# EAGLE design kilo (EAGLE 9.4.0)

## Sheet 1 of 5: ESP32
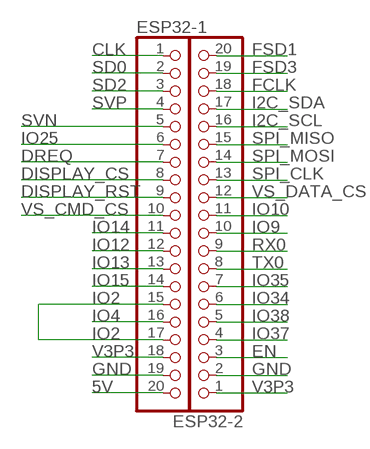
[diagram p0: schematic, sheet 1]

### Parts
ESP32-1  PINHD-1X20  [1X20]
ESP32-2  PINHD-1X20  [1X20]

### Nets
5V: ESP32-1.20
CLK: ESP32-1.1
DISPLAY_CS: ESP32-1.8 ; also sheet 3
DISPLAY_RST: ESP32-1.9 ; also sheet 3
DREQ: ESP32-1.7 ; also sheet 2
EN: ESP32-2.3
FCLK: ESP32-2.18
FSD1: ESP32-2.20
FSD3: ESP32-2.19
GND: ESP32-1.19 ESP32-2.2 ; also sheet 2,3,4,5
I2C_SCL: ESP32-2.16
I2C_SDA: ESP32-2.17
IO2: ESP32-1.15 ESP32-1.17 ; also sheet 4
IO4: ESP32-1.16 ; also sheet 4
IO9: ESP32-2.10 ; also sheet 3
IO10: ESP32-2.11 ; also sheet 5
IO12: ESP32-1.12 ; also sheet 4
IO13: ESP32-1.13 ; also sheet 4
IO14: ESP32-1.11 ; also sheet 4
IO15: ESP32-1.14 ; also sheet 4
IO25: ESP32-1.6 ; also sheet 5
IO34: ESP32-2.6
IO35: ESP32-2.7
IO37: ESP32-2.4 ; also sheet 5
IO38: ESP32-2.5 ; also sheet 5
RX0: ESP32-2.9
SD0: ESP32-1.2
SD2: ESP32-1.3
SPI_CLK: ESP32-2.13 ; also sheet 2,3
SPI_MISO: ESP32-2.15 ; also sheet 2,3
SPI_MOSI: ESP32-2.14 ; also sheet 2,3
SVN: ESP32-1.5
SVP: ESP32-1.4 ; also sheet 5
TX0: ESP32-2.8
V3P3: ESP32-1.18 ESP32-2.1 ; also sheet 2,3,4,5
VS_CMD_CS: ESP32-1.10 ; also sheet 2
VS_DATA_CS: ESP32-2.12 ; also sheet 2

## Sheet 2 of 5: VS1053
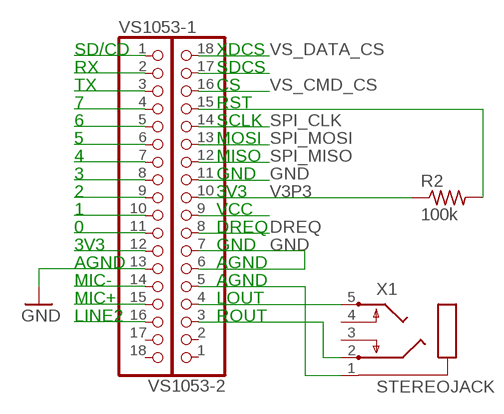
[diagram p1: schematic, sheet 2]

### Parts
R2  100k  R-US_0207/10  [0207/10]
VS1053-1  PINHD-1X18  [1X18]
VS1053-2  PINHD-1X18  [1X18]
X1  STEREOJACK  [STX3100]

### Nets
DREQ: VS1053-2.8 ; also sheet 1
GND: VS1053-1.13 VS1053-2.6 VS1053-2.7 VS1053-2.11 ; also sheet 1,3,4,5
N$1: VS1053-1.9
N$2: VS1053-1.1
N$3: VS1053-1.2
N$4: VS1053-1.3
N$5: VS1053-1.4
N$6: VS1053-1.5
N$7: VS1053-1.6
N$8: VS1053-1.7
N$9: VS1053-1.8
N$10: VS1053-1.10
N$11: VS1053-1.11
N$12: VS1053-1.12
N$13: VS1053-2.4 X1.5
N$14: VS1053-1.14
N$15: VS1053-1.15
N$16: VS1053-1.16
N$17: VS1053-2.3 X1.2
N$18: VS1053-2.17
N$20: R2.2 VS1053-2.15
N$21: VS1053-2.5 X1.1
N$26: VS1053-2.9
SPI_CLK: VS1053-2.14 ; also sheet 1,3
SPI_MISO: VS1053-2.12 ; also sheet 1,3
SPI_MOSI: VS1053-2.13 ; also sheet 1,3
V3P3: R2.1 VS1053-2.10 ; also sheet 1,3,4,5
VS_CMD_CS: VS1053-2.16 ; also sheet 1
VS_DATA_CS: VS1053-2.18 ; also sheet 1
Unconnected: VS1053-1.17 VS1053-1.18 VS1053-2.1 VS1053-2.2 X1.3 X1.4

### Notes on the sheet
- SD/CD | XDCS
- RX | SDCS
- TX | CS
- 7 | RST
- 6 | SCLK
- 5 | MOSI
- 4 | MISO
- 3 | GND
- 2 | 3V3
- 1 | VCC
- 0 | DREQ
- 3V3 | GND
- AGND | AGND
- MIC- | AGND
- MIC+ | LOUT
- LINE2 | ROUT

## Sheet 3 of 5: DISPLAY
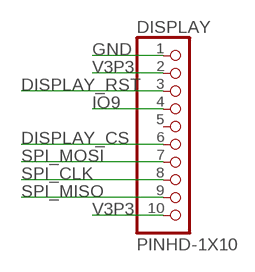
[diagram p2: schematic, sheet 3]

### Parts
DISPLAY  PINHD-1X10  [1X10-BIG]

### Nets
DISPLAY_CS: DISPLAY.6 ; also sheet 1
DISPLAY_RST: DISPLAY.3 ; also sheet 1
GND: DISPLAY.1 ; also sheet 1,2,4,5
IO9: DISPLAY.4 ; also sheet 1
SPI_CLK: DISPLAY.8 ; also sheet 1,2
SPI_MISO: DISPLAY.9 ; also sheet 1,2
SPI_MOSI: DISPLAY.7 ; also sheet 1,2
V3P3: DISPLAY.2 DISPLAY.10 ; also sheet 1,2,4,5
Unconnected: DISPLAY.5

## Sheet 4 of 5: SD CARD
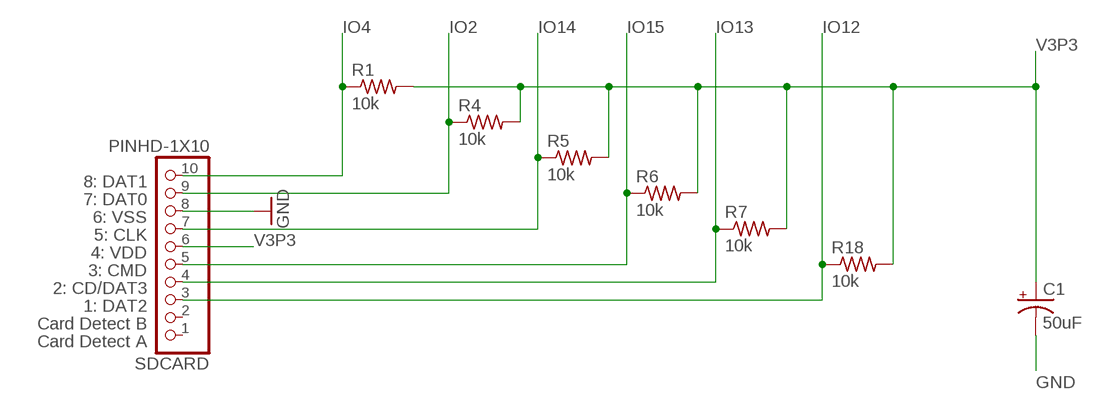
[diagram p3: schematic, sheet 4]

### Parts
C1  50uF  CPOL-USE2.5-7  [E2,5-7]
R1  10k  R-US_0207/10  [0207/10]
R4  10k  R-US_0207/10  [0207/10]
R5  10k  R-US_0207/10  [0207/10]
R6  10k  R-US_0207/10  [0207/10]
R7  10k  R-US_0207/10  [0207/10]
R18  10k  R-US_0207/10  [0207/10]
SDCARD  PINHD-1X10  [1X10-BIG]

### Nets
GND: C1.- SDCARD.8 ; also sheet 1,2,3,5
IO2: R4.1 SDCARD.9 ; also sheet 1
IO4: R1.1 SDCARD.10 ; also sheet 1
IO12: R18.1 SDCARD.3 ; also sheet 1
IO13: R7.1 SDCARD.4 ; also sheet 1
IO14: R5.1 SDCARD.7 ; also sheet 1
IO15: R6.1 SDCARD.5 ; also sheet 1
V3P3: C1.+ R1.2 R4.2 R5.2 R6.2 R7.2 R18.2 SDCARD.6 ; also sheet 1,2,3,5
Unconnected: SDCARD.1 SDCARD.2

### Notes on the sheet
- 8: DAT1
- 7: DAT0
- 6: VSS
- 5: CLK
- 4: VDD
- 3: CMD
- 2: CD/DAT3
- 1: DAT2
- Card Detect B
- Card Detect A

## Sheet 5 of 5: BUTTONS
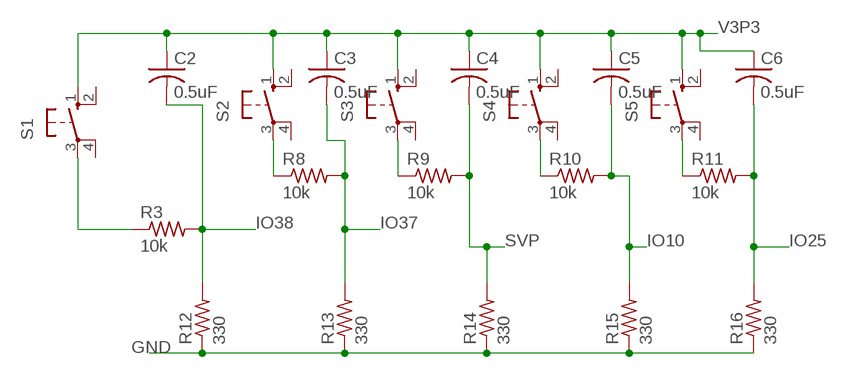
[diagram p4: schematic, sheet 5]

### Parts
C2  0.5uF  C-US025-024X044  [C025-024X044]
C3  0.5uF  C-US025-024X044  [C025-024X044]
C4  0.5uF  C-US025-024X044  [C025-024X044]
C5  0.5uF  C-US025-024X044  [C025-024X044]
C6  0.5uF  C-US025-024X044  [C025-024X044]
R3  10k  R-US_0207/10  [0207/10]
R8  10k  R-US_0207/10  [0207/10]
R9  10k  R-US_0207/10  [0207/10]
R10  10k  R-US_0207/10  [0207/10]
R11  10k  R-US_0207/10  [0207/10]
R12  330  R-US_0207/10  [0207/10]
R13  330  R-US_0207/10  [0207/10]
R14  330  R-US_0207/10  [0207/10]
R15  330  R-US_0207/10  [0207/10]
R16  330  R-US_0207/10  [0207/10]
S1  10-XX  [B3F-10XX]
S2  10-XX  [B3F-10XX]
S3  10-XX  [B3F-10XX]
S4  10-XX  [B3F-10XX]
S5  10-XX  [B3F-10XX]

### Nets
GND: R12.1 R13.1 R14.1 R15.1 R16.1 ; also sheet 1,2,3,4
IO10: C5.2 R10.2 R15.2 ; also sheet 1
IO25: C6.2 R11.2 R16.2 ; also sheet 1
IO37: C3.2 R8.2 R13.2 ; also sheet 1
IO38: C2.2 R3.2 R12.2 ; also sheet 1
N$19: R3.1 S1.3(P)
N$22: R8.1 S2.3(P)
N$23: R9.1 S3.3(P)
N$24: R10.1 S4.3(P)
N$25: R11.1 S5.3(P)
SVP: C4.2 R9.2 R14.2 ; also sheet 1
V3P3: C2.1 C3.1 C4.1 C5.1 C6.1 S1.1(S) S2.1(S) S3.1(S) S4.1(S) S5.1(S) ; also sheet 1,2,3,4
Unconnected: S1.2(S1) S1.4(P1) S2.2(S1) S2.4(P1) S3.2(S1) S3.4(P1) S4.2(S1) S4.4(P1) S5.2(S1) S5.4(P1)

## Library data of the parts
C1 = rcl:CPOL-US: POLARIZED CAPACITOR, American symbol; SPICEPREFIX: C
C2-C6 = rcl:C-US: CAPACITOR, American symbol; SPICEPREFIX: C
DISPLAY SDCARD = adafruit:PINHD-1X10: Pin header 1x10 0.1" spacing With round pins
ESP32-1 ESP32-2 = adafruit:PINHD-1X20: PIN HEADER
R1-R16 R18 = rcl:R-US_: RESISTOR, American symbol; SPICEPREFIX: R
S1-S5 = switch-omron:10-XX: OMRON SWITCH; MPN: B3F-1000; OC_FARNELL: 176432; OC_NEWARK: 36M3542
VS1053-1 VS1053-2 = adafruit:PINHD-1X18: PIN HEADER
X1 = adafruit:STEREOJACK: MIC/HEADPHONE JACK Stereo jack with two switches. Kycon STX3100, CUI SJ1-3555NG and/or 4UCon 05544

## Board
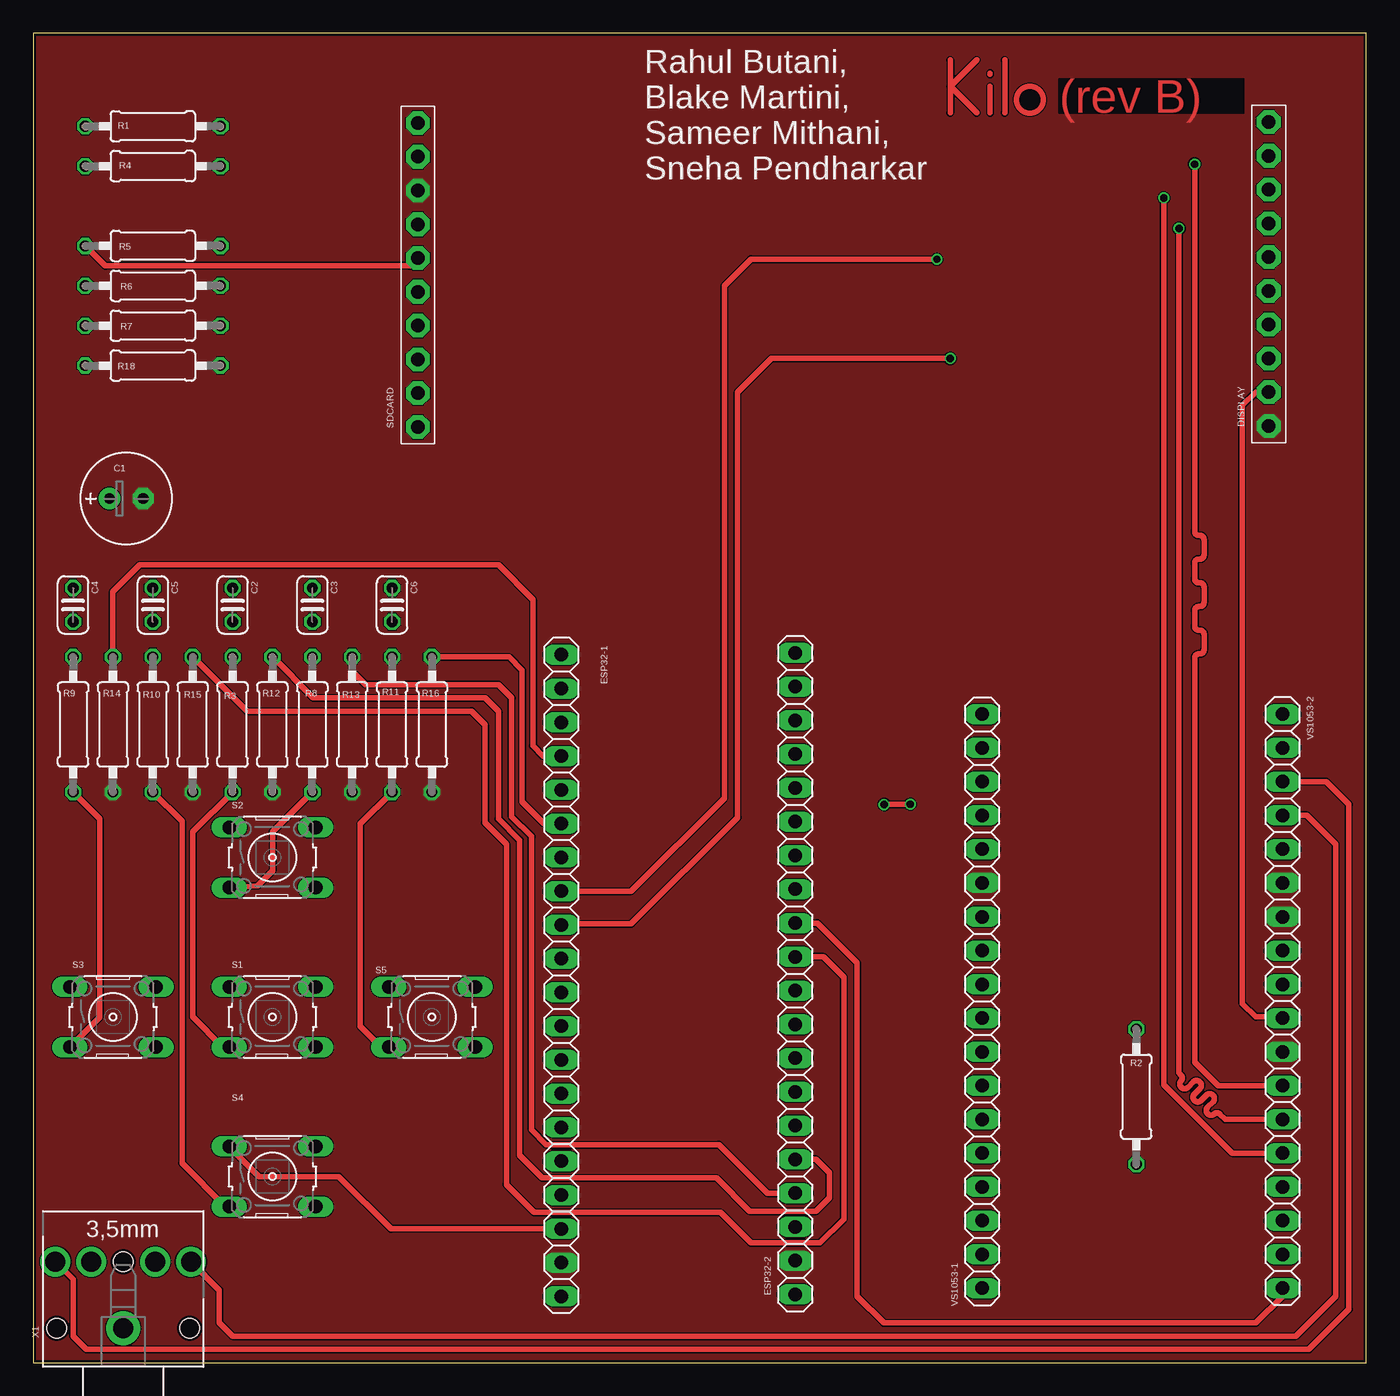
[diagram p5: board, top side]
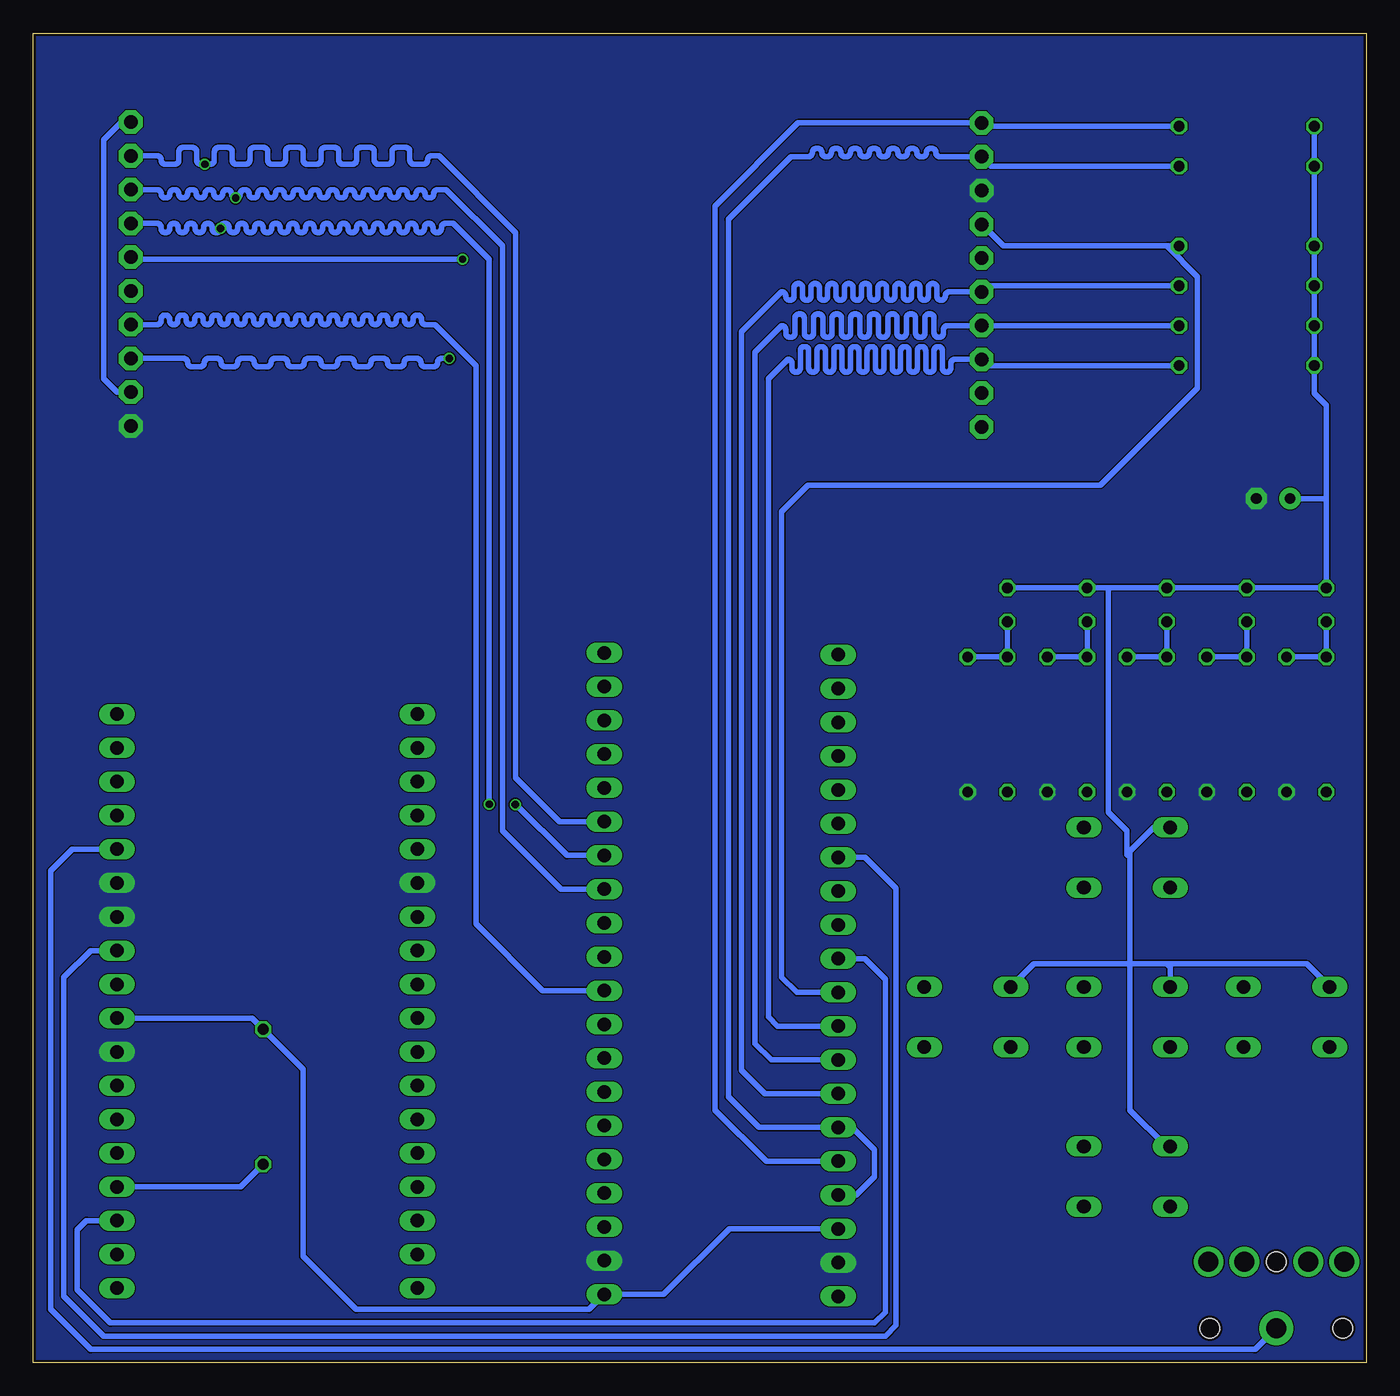
[diagram p6: board, bottom side, seen from below]

Size 100.31 x 100 mm. Coordinates in mm from the lower left corner, seen from the top.
Outline: 0,0 100.31,0 100.31,100 0,100 0,0
Copper layers (1*16): Top 0.035mm / dielectric 1.5mm / Bottom 0.035mm
Design rules "jlcpcb *": minimum track width 3.5mil, minimum drill 0.2mm, track to track 3.5mil, track to pad 3.5mil, pad to pad 6mil, via to via 6mil, smd to smd 6mil, copper to edge 0.2mm, drill to drill 0.2mm, minimum pad ring 3mil, minimum via ring 3mil, stop-mask expansion 4mil, vias tented up to drill 0mil, thermal gap 10mil

### Footprints (pad centres in the part's own frame; a part is rotated, then mirrored left to right if it is on the bottom)
E2,5-7 = drill 0.813 pad 1.6: + -1.27,0 | drill 0.813 pad 1.6 octagon: - 1.27,0
C025-024X044 = drill 0.813 octagon: 1 -1.27,0; 2 1.27,0
1X10-BIG = drill 1.016 pad 1.778 octagon: 1 -11.43,0; 2 -8.89,0; 3 -6.35,0; 4 -3.81,0; 5 -1.27,0; 6 1.27,0; 7 3.81,0; 8 6.35,0; 9 8.89,0; 10 11.43,0
1X20 = drill 1.016 long: 1 -24.13,0; 2 -21.59,0; 3 -19.05,0; 4 -16.51,0; 5 -13.97,0; 6 -11.43,0; 7 -8.89,0; 8 -6.35,0; 9 -3.81,0; 10 -1.27,0; 11 1.27,0; 12 3.81,0; 13 6.35,0; 14 8.89,0; 15 11.43,0; 16 13.97,0; 17 16.51,0; 18 19.05,0; 19 21.59,0; 20 24.13,0
0207/10 = drill 0.813 octagon: 1 -5.08,0; 2 5.08,0
B3F-10XX = drill 1.016 long: 1 -3.251,2.261; 2 3.251,2.261; 3 -3.251,-2.261; 4 3.251,-2.261
1X18 = drill 1.016 long: 1 -21.59,0; 2 -19.05,0; 3 -16.51,0; 4 -13.97,0; 5 -11.43,0; 6 -8.89,0; 7 -6.35,0; 8 -3.81,0; 9 -1.27,0; 10 1.27,0; 11 3.81,0; 12 6.35,0; 13 8.89,0; 14 11.43,0; 15 13.97,0; 16 16.51,0; 17 19.05,0; 18 21.59,0
STX3100 = drill 1.5 pad 2.54: 1 2.7,-0.1 | drill 1.5: 2 7.7,5; 3 7.7,2.3; 4 7.7,-2.5; 5 7.7,-5.2 | hole 1.5: 2.7,4.9; 2.7,-5.1; 7.7,-0.1

### Placement (x,y rotation side)
C1  7,65 0 top
C2  15,57 270 top
C3  21,57 270 top
C4  3,57 270 top
C5  9,57 270 top
C6  27,57 270 top
DISPLAY  92.97,81.89 90 top
ESP32-1  39.74,29.12 270 top
ESP32-2  57.34,29.26 90 top
R1  9,93 180 top
R2  83,20 270 top
R3  15,48 90 top
R4  9,90 180 top
R5  9,84 180 top
R6  9,81 180 top
R7  9,78 180 top
R8  21,48 90 top
R9  3,48 90 top
R10  9,48 90 top
R11  27,48 90 top
R12  18,48 90 top
R13  24,48 90 top
R14  6,48 90 top
R15  12,48 90 top
R16  30,48 90 top
R18  9,75 180 top
S1  18,26 0 top
S2  18,38 0 top
S3  6,26 0 top
S4  18,14 0 top
S5  30,26 0 top
SDCARD  28.94,81.82 90 top
VS1053-1  71.41,27.19 90 top
VS1053-2  94.01,27.19 270 top
X1  6.67,-0.11 90 top

### Tracks (layer width: path | path; a pad name or v marks a point on that pad's centre or on a via)
DISPLAY_CS  (via drill 0.55)
  Top 0.406: ESP32-1.8 45,35.47 52,42.47 52,81 54,83 v68,83
  Bottom 0.406: DISPLAY.6 92.81,83 v68,83
DISPLAY_RST  (via drill 0.55)
  Top 0.406: ESP32-1.9 39.81,33 45,33 53,41 53,73 55.54,75.54 v69,75.54
  Bottom 0.406: DISPLAY.3 89,75.54 arc90 88.69,75.23 arc-90 88.37,74.91 87.75,74.91 arc-90 87.43,75.23 arc90 87.12,75.54 86.49,75.54 arc90 86.18,75.23 arc-90 85.86,74.91 85.24,74.91 arc-90 84.93,75.23 arc90 84.61,75.54 83.99,75.54 arc90 83.67,75.23 arc-90 83.36,74.91 82.73,74.91 arc-90 82.42,75.23 arc90 82.11,75.54 81.48,75.54 arc90 81.17,75.23 arc-90 80.85,74.91 80.23,74.91 arc-90 79.91,75.23 arc90 79.6,75.54 78.97,75.54 arc90 78.66,75.23 arc-90 78.34,74.91 77.72,74.91 arc-90 77.41,75.23 arc90 77.09,75.54 76.47,75.54 arc90 76.15,75.23 arc-90 75.84,74.91 75.21,74.91 arc-90 74.9,75.23 arc90 74.58,75.54 73.96,75.54 arc90 73.65,75.23 arc-90 73.33,74.91 72.71,74.91 arc-90 72.39,75.23 arc90 72.08,75.54 71.45,75.54 arc90 71.14,75.23 arc-90 70.83,74.91 70.2,74.91 arc-90 69.89,75.23 arc90 69.57,75.54 v69,75.54
DREQ
  Bottom 0.406: ESP32-1.7 37.74,38.01 35.4,35.67 35.4,2.8 36.2,2 95,2 98,5 98,29 96,31 VS1053-2.8
GND
  pour Top (rank 2, no thermals): 0,100 100.2,100 100.2,0 0,0
  pour Bottom (rank 2, no thermals): 0,100 100.2,100 100.2,0 0,0
IO2
  Bottom 0.406: R4.1 28.23,90 SDCARD.9 32.07,90.71 arc90 32.39,91.02 arc-90 32.7,91.34 32.79,91.34 arc-90 33.1,91.02 arc90 33.42,90.71 33.51,90.71 arc90 33.82,91.02 arc-90 34.13,91.34 34.22,91.34 arc-90 34.53,91.02 arc90 34.85,90.71 34.94,90.71 arc90 35.25,91.02 arc-90 35.56,91.34 35.65,91.34 arc-90 35.96,91.02 arc90 36.28,90.71 36.37,90.71 arc90 36.68,91.02 arc-90 36.99,91.34 37.08,91.34 arc-90 37.4,91.02 arc90 37.71,90.71 37.8,90.71 arc90 38.11,91.02 arc-90 38.42,91.34 38.51,91.34 arc-90 38.83,91.02 arc90 39.14,90.71 39.23,90.71 arc90 39.54,91.02 arc-90 39.85,91.34 39.94,91.34 arc-90 40.26,91.02 arc90 40.57,90.71 40.66,90.71 arc90 40.97,91.02 arc-90 41.28,91.34 41.37,91.34 arc-90 41.69,91.02 arc90 42,90.71 43.29,90.71 48,86 48,20 45.69,17.69 ESP32-1.15 38.69,17.69 37,16 37,14 38.39,12.61 ESP32-1.17
IO4
  Bottom 0.406: R1.1 28.69,93 SDCARD.10 42.75,93.25 49,87 49,19 45.15,15.15 ESP32-1.16
IO9
  Bottom 0.406: DISPLAY.4 91,78.08 arc-90 90.69,78.39 90.69,78.49 arc90 90.37,78.8 90.37,78.8 arc90 90.05,78.49 90.05,78.39 arc-90 89.74,78.08 89.74,78.08 arc-90 89.42,78.39 89.42,78.49 arc90 89.11,78.8 89.1,78.8 arc90 88.79,78.49 88.79,78.39 arc-90 88.48,78.08 88.47,78.08 arc-90 88.16,78.39 88.16,78.49 arc90 87.84,78.8 87.84,78.8 arc90 87.53,78.49 87.53,78.39 arc-90 87.21,78.08 87.21,78.08 arc-90 86.89,78.39 86.89,78.49 arc90 86.58,78.8 86.58,78.8 arc90 86.26,78.49 86.26,78.39 arc-90 85.95,78.08 85.94,78.08 arc-90 85.63,78.39 85.63,78.49 arc90 85.32,78.8 85.31,78.8 arc90 85,78.49 85,78.39 arc-90 84.69,78.08 84.68,78.08 arc-90 84.37,78.39 84.37,78.49 arc90 84.05,78.8 84.05,78.8 arc90 83.73,78.49 83.73,78.39 arc-90 83.42,78.08 83.42,78.08 arc-90 83.1,78.39 83.1,78.49 arc90 82.79,78.8 82.79,78.8 arc90 82.47,78.49 82.47,78.39 arc-90 82.16,78.08 82.15,78.08 arc-90 81.84,78.39 81.84,78.49 arc90 81.53,78.8 81.52,78.8 arc90 81.21,78.49 81.21,78.39 arc-90 80.89,78.08 80.89,78.08 arc-90 80.58,78.39 80.58,78.49 arc90 80.26,78.8 80.26,78.8 arc90 79.94,78.49 79.94,78.39 arc-90 79.63,78.08 79.63,78.08 arc-90 79.31,78.39 79.31,78.49 arc90 79,78.8 78.99,78.8 arc90 78.68,78.49 78.68,78.39 arc-90 78.37,78.08 78.36,78.08 arc-90 78.05,78.39 78.05,78.49 arc90 77.73,78.8 77.73,78.8 arc90 77.42,78.49 77.42,78.39 arc-90 77.1,78.08 77.1,78.08 arc-90 76.78,78.39 76.78,78.49 arc90 76.47,78.8 76.47,78.8 arc90 76.15,78.49 76.15,78.39 arc-90 75.84,78.08 75.83,78.08 arc-90 75.52,78.39 75.52,78.49 arc90 75.21,78.8 75.2,78.8 arc90 74.89,78.49 74.89,78.39 arc-90 74.58,78.08 74.57,78.08 arc-90 74.26,78.39 74.26,78.49 arc90 73.94,78.8 73.94,78.8 arc90 73.62,78.49 73.62,78.39 arc-90 73.31,78.08 73.31,78.08 arc-90 72.99,78.39 72.99,78.49 arc90 72.68,78.8 72.68,78.8 arc90 72.36,78.49 72.36,78.39 arc-90 72.05,78.08 72.04,78.08 arc-90 71.73,78.39 71.73,78.49 arc90 71.42,78.8 71.41,78.8 arc90 71.1,78.49 71.1,78.39 arc-90 70.78,78.08 70.08,78.08 67,75 67,33 61.99,27.99 ESP32-2.10
IO10
  Top 0.406: R15.2 16.08,49 33,49 34,48 34,40.6 35.6,39 35.6,13.4 37.7,11.3 51.7,11.3 54,9 59.2,9 61,10.8 61,29 59.47,30.53 ESP32-2.11
  Bottom 0.406: R15.2 R10.2 C5.2
IO12
  Bottom 0.406: R18.1 28.47,75 SDCARD.3 30.95,75.47 arc-90 31.27,75.16 31.27,74.82 arc90 31.58,74.5 | 31.58,74.5 | 31.58,74.5 arc90 31.9,74.82 31.9,76.12 arc-90 32.21,76.44 32.21,76.44 arc-90 32.52,76.12 32.52,74.82 arc90 32.84,74.5 32.84,74.5 arc90 33.15,74.82 33.15,76.12 arc-90 33.47,76.44 | 33.47,76.44 | 33.47,76.44 arc-90 33.78,76.12 33.78,74.82 arc90 34.1,74.5 | 34.1,74.5 | 34.1,74.5 arc90 34.41,74.82 34.41,76.12 arc-90 34.73,76.44 | 34.73,76.44 | 34.73,76.44 arc-90 35.04,76.12 35.04,74.82 arc90 35.35,74.5 | 35.35,74.5 | 35.35,74.5 arc90 35.67,74.82 35.67,76.12 arc-90 35.98,76.44 | 35.98,76.44 | 35.98,76.44 arc-90 36.3,76.12 36.3,74.82 arc90 36.61,74.5 | 36.61,74.5 | 36.61,74.5 arc90 36.93,74.82 36.93,76.12 arc-90 37.24,76.44 37.24,76.44 arc-90 37.56,76.12 37.56,74.82 arc90 37.87,74.5 | 37.87,74.5 | 37.87,74.5 arc90 38.19,74.82 38.19,76.12 arc-90 38.5,76.44 | 38.5,76.44 | 38.5,76.44 arc-90 38.81,76.12 38.81,74.82 arc90 39.13,74.5 | 39.13,74.5 | 39.13,74.5 arc90 39.44,74.82 39.44,76.12 arc-90 39.76,76.44 | 39.76,76.44 | 39.76,76.44 arc-90 40.07,76.12 40.07,74.82 arc90 40.39,74.5 | 40.39,74.5 | 40.39,74.5 arc90 40.7,74.82 40.7,76.12 arc-90 41.02,76.44 | 41.02,76.44 | 41.02,76.44 arc-90 41.33,76.12 41.33,74.82 arc90 41.64,74.5 41.64,74.5 arc90 41.96,74.82 41.96,76.12 arc-90 42.27,76.44 | 42.27,76.44 | 42.27,76.44 arc-90 42.59,76.12 42.59,74.82 arc90 42.9,74.5 | 42.9,74.5 | 42.9,74.5 arc90 43.22,74.82 43.22,75.16 arc-90 43.53,75.47 45,74 45,26 44.31,25.31 ESP32-1.12
IO13
  Bottom 0.406: R7.1 SDCARD.4 31.51,78.01 arc-90 31.82,77.7 31.82,77.45 arc90 32.14,77.14 32.2,77.14 arc90 32.52,77.45 32.52,78.57 arc-90 32.83,78.88 32.9,78.88 arc-90 33.22,78.57 33.22,77.45 arc90 33.53,77.14 33.6,77.14 arc90 33.91,77.45 33.91,78.57 arc-90 34.23,78.88 34.3,78.88 arc-90 34.61,78.57 34.61,77.45 arc90 34.93,77.14 35,77.14 arc90 35.31,77.45 35.31,78.57 arc-90 35.62,78.88 35.69,78.88 arc-90 36.01,78.57 36.01,77.45 arc90 36.32,77.14 36.39,77.14 arc90 36.71,77.45 36.71,78.57 arc-90 37.02,78.88 37.09,78.88 arc-90 37.41,78.57 37.41,77.45 arc90 37.72,77.14 37.79,77.14 arc90 38.1,77.45 38.1,78.57 arc-90 38.42,78.88 38.49,78.88 arc-90 38.8,78.57 38.8,77.45 arc90 39.12,77.14 39.18,77.14 arc90 39.5,77.45 39.5,78.57 arc-90 39.81,78.88 39.88,78.88 arc-90 40.2,78.57 40.2,77.45 arc90 40.51,77.14 40.58,77.14 arc90 40.89,77.45 40.89,78.57 arc-90 41.21,78.88 41.28,78.88 arc-90 41.59,78.57 41.59,77.45 arc90 41.91,77.14 41.98,77.14 arc90 42.29,77.45 42.29,78.57 arc-90 42.6,78.88 42.67,78.88 arc-90 42.99,78.57 42.99,77.45 arc90 43.3,77.14 43.37,77.14 arc90 43.69,77.45 43.69,77.7 arc-90 44,78.01 46,76.01 46,24 44.77,22.77 ESP32-1.13
IO14
  Bottom 0.406: SDCARD.7 27.31,84 15,84 | R5.1 15,84 | 15,84 12.7,81.7 12.7,73.3 20,66 42,66 44,64 44,29 42.85,27.85 ESP32-1.11
IO15
  Bottom 0.406: R6.1 28.49,81 SDCARD.5 31.37,80.55 arc-90 31.68,80.24 arc90 32,79.92 32,79.92 arc90 32.31,80.24 32.31,80.86 arc-90 32.63,81.18 32.63,81.18 arc-90 32.95,80.86 32.95,80.24 arc90 33.26,79.92 33.26,79.92 arc90 33.58,80.24 33.58,80.86 arc-90 33.89,81.18 33.9,81.18 arc-90 34.21,80.86 34.21,80.24 arc90 34.52,79.92 34.53,79.92 arc90 34.84,80.24 34.84,80.86 arc-90 35.16,81.18 35.16,81.18 arc-90 35.47,80.86 35.47,80.24 arc90 35.79,79.92 35.79,79.92 arc90 36.1,80.24 36.1,80.86 arc-90 36.42,81.18 36.42,81.18 arc-90 36.74,80.86 36.74,80.24 arc90 37.05,79.92 37.05,79.92 arc90 37.37,80.24 37.37,80.86 arc-90 37.68,81.18 37.69,81.18 arc-90 38,80.86 38,80.24 arc90 38.31,79.92 38.32,79.92 arc90 38.63,80.24 38.63,80.86 arc-90 38.95,81.18 38.95,81.18 arc-90 39.26,80.86 39.26,80.24 arc90 39.58,79.92 39.58,79.92 arc90 39.9,80.24 39.9,80.86 arc-90 40.21,81.18 40.21,81.18 arc-90 40.53,80.86 40.53,80.24 arc90 40.84,79.92 40.84,79.92 arc90 41.16,80.24 41.16,80.86 arc-90 41.47,81.18 41.48,81.18 arc-90 41.79,80.86 41.79,80.24 arc90 42.1,79.92 42.11,79.92 arc90 42.42,80.24 42.42,80.86 arc-90 42.74,81.18 42.74,81.18 arc-90 43.05,80.86 43.05,80.24 arc90 43.37,79.92 43.37,79.92 arc90 43.69,80.24 arc-90 44,80.55 47,77.55 47,22 45.23,20.23 ESP32-1.14
IO25
  Top 0.406: R16.2 35.8,53.08 36.8,52.08 36.8,42.2 38.45,40.55 ESP32-1.6
  Bottom 0.406: C6.2 R11.2 R16.2
IO37
  Top 0.406: ESP32-2.4 55.25,12.75 51.6,16.4 38.6,16.4 37.5,17.5 37.5,39.58 36,41.08 36,50 35,51 25,51 24,52 R13.2
  Bottom 0.406: C3.2 R8.2 R13.2
IO38
  Top 0.406: R12.2 21.08,50 34,50 35,49 35,40.9 36.6,39.3 36.6,15.6 38.3,13.9 51.4,13.9 53.9,11.4 58.9,11.4 59.9,12.4 59.9,14.3 58.91,15.29 ESP32-2.5
  Bottom 0.406: C2.2 R3.2 R12.2
N$13
  Top 0.406: X1.5 14,5.46 14,3 15,2 95,2 98,5 98,39 95.84,41.16 VS1053-2.4
N$17
  Top 0.406: X1.2 3,6.26 3,2 4,1 96,1 99,4 99,42 97.3,43.7 VS1053-2.3
N$19
  Top 0.406: R3.1 12,39.92 12,26 14.26,23.74 S1.3
N$20
  Bottom 0.406: R2.2 84.7,13.22 VS1053-2.15
N$21
  Bottom 0.406: X1.1 8.36,1 96,1 99,4 99,37 97.38,38.62 VS1053-2.5
N$22
  Top 0.406: R8.1 18,39.92 18,37 16.89,35.89 S2.3
N$23
  Top 0.406: R9.1 5,40.92 5,25.99 S3.3
N$24
  Top 0.406: R10.1 11.2,40.72 11.2,15 14.46,11.74 S4.3
N$25
  Top 0.406: S5.3 26.16,23.74 24.6,25.3 24.6,40.52 R11.1
N$27
  Top 0.406: 69,98 69,96
N$28
  Top 0.406: 69,96 69,94
N$29
  Top 0.406: 69,96 71,98
N$30
  Top 0.406: 69,96 71,94
N$31
  Top 0.406: 72,96 72,94
N$32
  Top 0.406: 72,97 72,96.9
N$33
  Top 0.406: 73.1,98 73.1,94
SPI_CLK  (via drill 0.55)
  Top 0.406: v85.08,87.61 85.08,20.92 90.24,15.76 VS1053-2.14
  Bottom 0.406: ESP32-2.13 60.61,35.61 65,40 65,84 69.24,88.24 69.86,88.24 arc-90 70.17,87.93 arc90 70.49,87.61 70.52,87.61 arc90 70.84,87.93 arc-90 71.15,88.24 71.18,88.24 arc-90 71.5,87.93 arc90 71.81,87.61 71.84,87.61 arc90 72.16,87.93 arc-90 72.47,88.24 72.51,88.24 arc-90 72.82,87.93 arc90 73.14,87.61 73.17,87.61 arc90 73.48,87.93 arc-90 73.8,88.24 73.83,88.24 arc-90 74.14,87.93 arc90 74.46,87.61 74.49,87.61 arc90 74.81,87.93 arc-90 75.12,88.24 75.15,88.24 arc-90 75.47,87.93 arc90 75.78,87.61 75.81,87.61 arc90 76.13,87.93 arc-90 76.44,88.24 76.48,88.24 arc-90 76.79,87.93 arc90 77.11,87.61 77.14,87.61 arc90 77.45,87.93 arc-90 77.77,88.24 77.8,88.24 arc-90 78.11,87.93 arc90 78.43,87.61 78.46,87.61 arc90 78.78,87.93 arc-90 79.09,88.24 79.12,88.24 arc-90 79.44,87.93 arc90 79.75,87.61 79.78,87.61 arc90 80.1,87.93 arc-90 80.41,88.24 80.45,88.24 arc-90 80.76,87.93 arc90 81.08,87.61 81.11,87.61 arc90 81.42,87.93 arc-90 81.74,88.24 81.77,88.24 arc-90 82.08,87.93 arc90 82.4,87.61 82.43,87.61 arc90 82.75,87.93 arc-90 83.06,88.24 83.09,88.24 arc-90 83.41,87.93 arc90 83.72,87.61 83.75,87.61 arc90 84.07,87.93 arc-90 84.38,88.24 84.42,88.24 arc-90 84.73,87.93 arc90 85.05,87.61 v85.08,87.61 arc90 85.39,87.93 arc-90 85.71,88.24 85.74,88.24 arc-90 86.05,87.93 arc90 86.37,87.61 86.4,87.61 arc90 86.72,87.93 arc-90 87.03,88.24 87.06,88.24 arc-90 87.38,87.93 arc90 87.69,87.61 87.72,87.61 arc90 88.04,87.93 arc-90 88.35,88.24 88.39,88.24 arc-90 88.7,87.93 arc90 89.02,87.61 89.05,87.61 arc90 89.36,87.93 arc-90 89.68,88.24 89.71,88.24 arc-90 90.02,87.93 arc90 90.34,87.61 90.37,87.61 arc90 90.69,87.93 arc-90 91,88.24 DISPLAY.8
SPI_MISO  (via drill 0.55)
  Top 0.406: v87.4,90.15 87.4,62.54 arc90 87.71,62.23 87.79,62.23 arc-90 88.11,61.91 88.11,60.76 arc-90 87.79,60.45 87.71,60.45 arc90 87.4,60.13 87.4,58.98 arc90 87.71,58.66 87.79,58.66 arc-90 88.11,58.35 88.11,57.19 arc-90 87.79,56.88 87.71,56.88 arc90 87.4,56.56 87.4,55.41 arc90 87.71,55.1 87.79,55.1 arc-90 88.11,54.78 88.11,53.63 arc-90 87.79,53.31 87.71,53.31 arc90 87.4,53 87.4,22.6 89.16,20.84 VS1053-2.12
  Bottom 0.406: ESP32-2.15 60.69,40.69 64,44 64,85 69.78,90.78 70.32,90.78 arc-90 70.64,90.47 arc90 70.95,90.15 71.66,90.15 arc90 71.97,90.47 71.97,91.09 arc-90 72.29,91.41 73,91.41 arc-90 73.31,91.09 73.31,90.47 arc90 73.62,90.15 74.33,90.15 arc90 74.65,90.47 74.65,91.09 arc-90 74.96,91.41 75.67,91.41 arc-90 75.98,91.09 75.98,90.47 arc90 76.3,90.15 77,90.15 arc90 77.32,90.47 77.32,91.09 arc-90 77.63,91.41 78.34,91.41 arc-90 78.66,91.09 78.66,90.47 arc90 78.97,90.15 79.68,90.15 arc90 79.99,90.47 79.99,91.09 arc-90 80.31,91.41 81.02,91.41 arc-90 81.33,91.09 81.33,90.47 arc90 81.64,90.15 82.35,90.15 arc90 82.67,90.47 82.67,91.09 arc-90 82.98,91.41 83.69,91.41 arc-90 84,91.09 84,90.47 arc90 84.32,90.15 85.03,90.15 arc90 85.34,90.47 85.34,91.09 arc-90 85.65,91.41 86.36,91.41 arc-90 86.68,91.09 86.68,90.47 arc90 86.99,90.15 v87.4,90.15 87.7,90.15 arc90 88.01,90.47 88.01,91.09 arc-90 88.33,91.41 89.03,91.41 arc-90 89.35,91.09 89.35,90.47 arc90 89.66,90.15 90.37,90.15 arc90 90.69,90.47 arc-90 91,90.78 DISPLAY.9
SPI_MOSI  (via drill 0.55)
  Top 0.406: v64.03,41.98 64.05,42 v66,42 | v86.21,85.31 86.21,21.79 86.36,21.64 arc-90 86.36,21.19 arc90 86.36,20.75 86.42,20.69 arc90 86.86,20.69 87.31,21.14 arc-90 87.75,21.14 87.81,21.08 arc-90 87.81,20.64 87.36,20.19 arc90 87.36,19.75 87.42,19.7 arc90 87.86,19.7 88.3,20.14 arc-90 88.75,20.14 88.8,20.09 arc-90 88.8,19.64 88.36,19.2 arc90 88.36,18.75 88.41,18.7 arc90 88.86,18.7 arc-90 89.3,18.7 89.7,18.3 VS1053-2.13
  Bottom 0.406: v66,42 66,83 68.7,85.7 69.28,85.7 arc-90 69.6,85.39 69.6,85.31 arc90 69.91,85 69.92,85 arc90 70.24,85.31 70.24,85.39 arc-90 70.55,85.7 70.56,85.7 arc-90 70.88,85.39 70.88,85.31 arc90 71.19,85 71.2,85 arc90 71.52,85.31 71.52,85.39 arc-90 71.83,85.7 71.84,85.7 arc-90 72.15,85.39 72.15,85.31 arc90 72.47,85 72.48,85 arc90 72.79,85.31 72.79,85.39 arc-90 73.11,85.7 73.12,85.7 arc-90 73.43,85.39 73.43,85.31 arc90 73.75,85 73.76,85 arc90 74.07,85.31 74.07,85.39 arc-90 74.39,85.7 74.4,85.7 arc-90 74.71,85.39 74.71,85.31 arc90 75.02,85 75.03,85 arc90 75.35,85.31 75.35,85.39 arc-90 75.66,85.7 75.67,85.7 arc-90 75.99,85.39 75.99,85.31 arc90 76.3,85 76.31,85 arc90 76.63,85.31 76.63,85.39 arc-90 76.94,85.7 76.95,85.7 arc-90 77.27,85.39 77.27,85.31 arc90 77.58,85 77.59,85 arc90 77.91,85.31 77.91,85.39 arc-90 78.22,85.7 78.23,85.7 arc-90 78.54,85.39 78.54,85.31 arc90 78.86,85 78.87,85 arc90 79.18,85.31 79.18,85.39 arc-90 79.5,85.7 79.51,85.7 arc-90 79.82,85.39 79.82,85.31 arc90 80.14,85 80.15,85 arc90 80.46,85.31 80.46,85.39 arc-90 80.78,85.7 80.79,85.7 arc-90 81.1,85.39 81.1,85.31 arc90 81.42,85 81.42,85 arc90 81.74,85.31 81.74,85.39 arc-90 82.05,85.7 82.06,85.7 arc-90 82.38,85.39 82.38,85.31 arc90 82.69,85 82.7,85 arc90 83.02,85.31 83.02,85.39 arc-90 83.33,85.7 83.34,85.7 arc-90 83.66,85.39 83.66,85.31 arc90 83.97,85 83.98,85 arc90 84.3,85.31 84.3,85.39 arc-90 84.61,85.7 84.62,85.7 arc-90 84.93,85.39 84.93,85.31 arc90 85.25,85 85.26,85 arc90 85.57,85.31 85.57,85.39 arc-90 85.89,85.7 85.9,85.7 arc-90 86.21,85.39 v86.21,85.31 arc90 86.53,85 86.54,85 arc90 86.85,85.31 86.85,85.39 arc-90 87.17,85.7 87.18,85.7 arc-90 87.49,85.39 87.49,85.31 arc90 87.81,85 87.81,85 arc90 88.13,85.31 88.13,85.39 arc-90 88.44,85.7 88.45,85.7 arc-90 88.77,85.39 88.77,85.31 arc90 89.08,85 89.09,85 arc90 89.41,85.31 89.41,85.39 arc-90 89.72,85.7 89.73,85.7 arc-90 90.05,85.39 90.05,85.31 arc90 90.36,85 90.37,85 arc90 90.69,85.31 90.69,85.39 arc-90 91,85.7 DISPLAY.7
  Bottom 0.406: ESP32-2.14 60.15,38.15 63.98,41.98 v64.03,41.98
SVP
  Top 0.406: R14.2 6,58 8,60 35,60 37.6,57.4 37.6,46.4 38.37,45.63 ESP32-1.4
  Bottom 0.406: C4.2 R9.2 R14.2
V3P3
  Top 0.406: SDCARD.6 28.35,82.5 5.42,82.5 R5.2 | ESP32-1.18 26.93,10.07 23,14 17,14 S4.1 | VS1053-2.10 93.93,26 92,26 91,27 91,72 92,73 DISPLAY.2
  Bottom 0.406: ESP32-1.18 47.93,10.07 52.87,5.13 ESP32-2.1 58.47,4 76,4 80,8 80,22.08 R2.1 83.84,25.92 VS1053-2.10 | 19.4,58.27 C2.1 C5.1 C4.1 3,65 | 19.4,58.27 C3.1 C6.1 | S3.1 4.49,30 15,30 | S5.1 25.01,30 17.8,30 | 15,30 17.8,30 | S1.1 14.75,29.75 15,30 | S2.1 16,40.26 17.8,38.46 17.8,38 | 17.8,38 17.8,30 | 17.8,30 17.8,19 15.06,16.26 S4.1 | 17.8,38 18,38.2 18,40 19.4,41.4 19.4,58.27 | 3,65 3,72 3.92,72.92 R18.2 R7.2 R6.2 R5.2 R4.2 R1.2 | 3,65 C1.+ | DISPLAY.2 94,73 95,74 95,92 93.68,93.32 DISPLAY.10
VS_CMD_CS
  Bottom 0.406: ESP32-1.10 37.74,30.39 36.2,28.85 36.2,3.8 37,3 94.5,3 97,5.5 97,10 96.32,10.68 VS1053-2.16
VS_DATA_CS
  Top 0.406: ESP32-2.12 59,33.07 62,30.07 62,5 64,3 92,3 94.01,5.01 VS1053-2.18
(copper drawn outside any net)
  shapes: Top circle x1

### Text on the board
Top: (rev B)
tPlace: Rahul Butani, / Blake Martini, / Sameer Mithani, / Sneha Pendharkar